# Altium schematic sheet DSP.SchDoc
size 381 x 241 mm
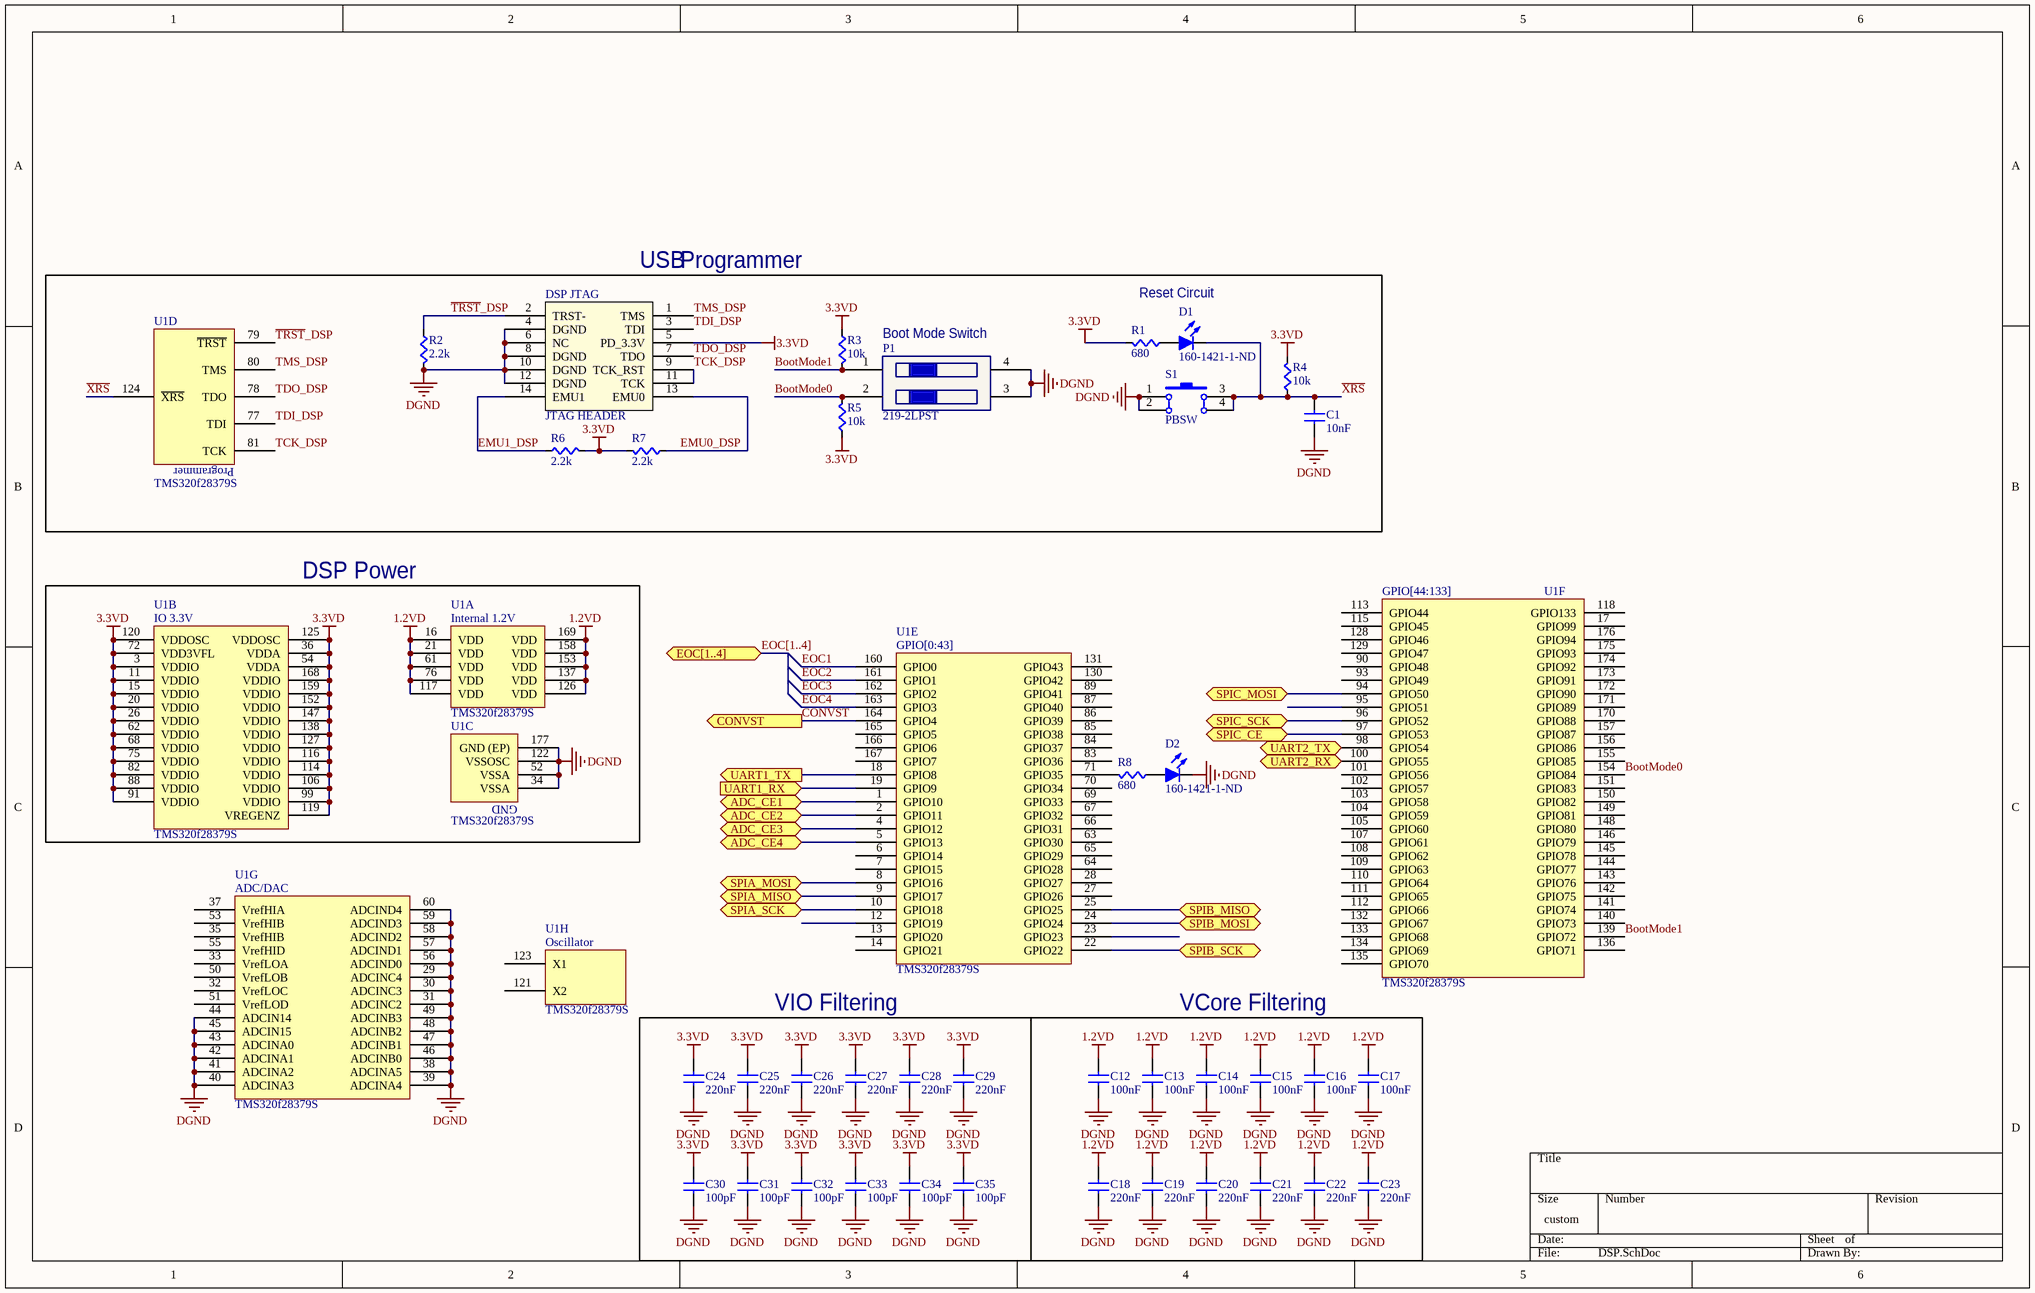
[diagram p0: DSP.SchDoc]

## Parts
C1  value 10nF  [CAPC0603]  (hidden comment: Cap)
C12  value 100nF  [CAPC0603]  (hidden comment: Cap)
C13  value 100nF  [CAPC0603]  (hidden comment: Cap)
C14  value 100nF  [CAPC0603]  (hidden comment: Cap)
C15  value 100nF  [CAPC0603]  (hidden comment: Cap)
C16  value 100nF  [CAPC0603]  (hidden comment: Cap)
C17  value 100nF  [CAPC0603]  (hidden comment: Cap)
C18  value 220nF  [CAPC0603]  (hidden comment: Cap)
C19  value 220nF  [CAPC0603]  (hidden comment: Cap)
C20  value 220nF  [CAPC0603]  (hidden comment: Cap)
C21  value 220nF  [CAPC0603]  (hidden comment: Cap)
C22  value 220nF  [CAPC0603]  (hidden comment: Cap)
C23  value 220nF  [CAPC0603]  (hidden comment: Cap)
C24  value 220nF  [CAPC0603]  (hidden comment: Cap)
C25  value 220nF  [CAPC0603]  (hidden comment: Cap)
C26  value 220nF  [CAPC0603]  (hidden comment: Cap)
C27  value 220nF  [CAPC0603]  (hidden comment: Cap)
C28  value 220nF  [CAPC0603]  (hidden comment: Cap)
C29  value 220nF  [CAPC0603]  (hidden comment: Cap)
C30  value 100pF  [CAPC0603]  (hidden comment: Cap)
C31  value 100pF  [CAPC0603]  (hidden comment: Cap)
C32  value 100pF  [CAPC0603]  (hidden comment: Cap)
C33  value 100pF  [CAPC0603]  (hidden comment: Cap)
C34  value 100pF  [CAPC0603]  (hidden comment: Cap)
C35  value 100pF  [CAPC0603]  (hidden comment: Cap)
D1  Supplier Part Number 1: 160-1421-1-ND  [LED0805-RED]  (hidden comment: LED-RED)
D2  Supplier Part Number: 160-1421-1-ND  [LED0805-RED]  (hidden comment: LED-RED)
DSP_JTAG  JTAG HEADER  [JTAG HEADER - 14]
P1  219-2LPST  [SPST-4N]
R1  value 680  [RES0603]  (hidden comment: Res)
R2  value 2.2k  [RES0603]  (hidden comment: Res)
R3  value 10k  [RES0603]  (hidden comment: Res)
R4  value 10k  [RES0603]  (hidden comment: Res)
R5  value 10k  [RES0603]  (hidden comment: Res)
R6  value 2.2k  [RES0603]  (hidden comment: Res)
R7  value 2.2k  [RES0603]  (hidden comment: Res)
R8  value 680  [RES0603]  (hidden comment: Res)
S1  PBSW  [PBSW]
U1  TMS320f28379S  [PQFP-177N]  (parts A,B,C,D,E,F,G,H of 8)

## Blocks framed on the sheet
DSP Power: U1
VIO Filtering: C24-C35
VCore Filtering: C12-C23

## Ports
ADC_CE1 (bidir), ADC_CE2 (bidir), ADC_CE3 (bidir), ADC_CE4 (bidir), CONVST (out), EOC[1..4] (bidir), SPIA_MISO (bidir), SPIA_MOSI (bidir), SPIA_SCK (bidir), SPIB_MISO (bidir), SPIB_MOSI (bidir), SPIB_SCK (bidir), SPIC_CE (bidir), SPIC_MOSI (bidir), SPIC_SCK (bidir), UART1_RX (in), UART1_TX (out), UART2_RX (in), UART2_TX (out)

## Nets
1: S1.2(A')
1.2VD: C12.1(A) C13.1(A) C14.1(A) C15.1(A) C16.1(A) C17.1(A) C18.1(A) C19.1(A) C20.1(A) C21.1(A) C22.1(A) C23.1(A) U1.16(VDD) U1.21(VDD) U1.61(VDD) U1.76(VDD) U1.117(VDD) U1.126(VDD) U1.137(VDD) U1.153(VDD) U1.158(VDD) U1.169(VDD)
3: S1.4(B')
3.3VD: C24.1(A) C25.1(A) C26.1(A) C27.1(A) C28.1(A) C29.1(A) C30.1(A) C31.1(A) C32.1(A) C33.1(A) C34.1(A) C35.1(A) DSP_JTAG.5(PD_3.3V) R1.1(A) R3.2(B) R4.1(A) R5.2(B) R6.1(A) R7.1(A) U1.3(VDDIO) U1.11(VDDIO) U1.15(VDDIO) U1.20(VDDIO) U1.26(VDDIO) U1.36(VDDA) U1.54(VDDA) U1.62(VDDIO) U1.68(VDDIO) U1.72(VDD3VFL) U1.75(VDDIO) U1.82(VDDIO) U1.88(VDDIO) U1.91(VDDIO) U1.99(VDDIO) U1.106(VDDIO) U1.114(VDDIO) U1.116(VDDIO) U1.119(VREGENZ) U1.120(VDDOSC) U1.125(VDDOSC) U1.127(VDDIO) U1.138(VDDIO) U1.147(VDDIO) U1.152(VDDIO) U1.159(VDDIO) U1.168(VDDIO)
DGND: C1.2(B) C12.2(B) C13.2(B) C14.2(B) C15.2(B) C16.2(B) C17.2(B) C18.2(B) C19.2(B) C20.2(B) C21.2(B) C22.2(B) C23.2(B) C24.2(B) C25.2(B) C26.2(B) C27.2(B) C28.2(B) C29.2(B) C30.2(B) C31.2(B) C32.2(B) C33.2(B) C34.2(B) C35.2(B) D2.1(K) DSP_JTAG.4(DGND) DSP_JTAG.6(NC) DSP_JTAG.8(DGND) DSP_JTAG.10(DGND) DSP_JTAG.12(DGND) P1.3 P1.4 R2.1(A) S1.1(A) S1.2(A') U1.29(ADCINC4) U1.30(ADCINC3) U1.31(ADCINC2) U1.34(VSSA) U1.38(ADCINA5) U1.39(ADCINA4) U1.40(ADCINA3) U1.41(ADCINA2) U1.42(ADCINA1) U1.43(ADCINA0) U1.44(ADCIN14) U1.45(ADCIN15) U1.46(ADCINB0) U1.47(ADCINB1) U1.48(ADCINB2) U1.49(ADCINB3) U1.52(VSSA) U1.56(ADCIND0) U1.57(ADCIND1) U1.58(ADCIND2) U1.59(ADCIND3) U1.60(ADCIND4) U1.122(VSSOSC) U1.177(GND_(EP))
ADC_CE1: U1.1(GPIO10) ; port ADC_CE1
ADC_CE2: U1.2(GPIO11) ; port ADC_CE2
ADC_CE3: U1.4(GPIO12) ; port ADC_CE3
ADC_CE4: U1.5(GPIO13) ; port ADC_CE4
BootMode0: P1.2 R5.1(A) U1.154(GPIO84)
BootMode1: P1.1 R3.1(A) U1.139(GPIO72)
CONVST: U1.164(GPIO4) ; port CONVST
EMU0_DSP: DSP_JTAG.13(EMU0) R7.2(B)
EMU1_DSP: DSP_JTAG.14(EMU1) R6.2(B)
EOC1: U1.160(GPIO0)
EOC2: U1.161(GPIO1)
EOC3: U1.162(GPIO2)
EOC4: U1.163(GPIO3)
SPIA_MISO: U1.9(GPIO17) ; port SPIA_MISO
SPIA_MOSI: U1.8(GPIO16) ; port SPIA_MOSI
SPIA_SCK: U1.10(GPIO18) ; port SPIA_SCK
SPIB_MISO: U1.25(GPIO25) ; port SPIB_MISO
SPIB_MOSI: U1.24(GPIO24) ; port SPIB_MOSI
SPIB_SCK: U1.22(GPIO22) ; port SPIB_SCK
SPIC_CE: U1.97(GPIO53) ; port SPIC_CE
SPIC_MOSI: U1.94(GPIO50) ; port SPIC_MOSI
SPIC_SCK: U1.96(GPIO52) ; port SPIC_SCK
~{TRST}_DSP: DSP_JTAG.2(TRST-) R2.2(B) U1.79(~{TRST})
TCK_DSP: DSP_JTAG.9(TCK_RST) DSP_JTAG.11(TCK) U1.81(TCK)
TDI_DSP: DSP_JTAG.3(TDI) U1.77(TDI)
TDO_DSP: DSP_JTAG.7(TDO) U1.78(TDO)
TMS_DSP: DSP_JTAG.1(TMS) U1.80(TMS)
UART1_RX: U1.19(GPIO9) ; port UART1_RX
UART1_TX: U1.18(GPIO8) ; port UART1_TX
UART2_RX: U1.100(GPIO55) ; port UART2_RX
UART2_TX: U1.98(GPIO54) ; port UART2_TX
~{XRS}: C1.1(A) D1.1(K) R4.2(B) S1.3(B) S1.4(B') U1.124(~{XRS})
NetD1_2: D1.2(A) R1.2(B)
NetD2_2: D2.2(A) R8.2(B)
NetR8_1: R8.1(A) U1.71(GPIO35)

Not connected (* = marked no-connect by the designer): U1 6(GPIO14) 7(GPIO15) 12(GPIO19) 13(GPIO20) 14(GPIO21) 17(GPIO99) 23(GPIO23) 27(GPIO26) 28(GPIO27) 32(VrefLOC) 33(VrefLOA) 35(VrefHIB) 37(VrefHIA) 50(VrefLOB) 51(VrefLOD) 53(VrefHIB) 55(VrefHID) 63(GPIO30) 64(GPIO28) 65(GPIO29) 66(GPIO31) 67(GPIO32) 69(GPIO33) 70(GPIO34) 83(GPIO36) 84(GPIO37) 85(GPIO38) 86(GPIO39) 87(GPIO40) 89(GPIO41) 90(GPIO48) 93(GPIO49) 95(GPIO51) 101(GPIO56) 102(GPIO57) 103(GPIO58) 104(GPIO59) 105(GPIO60) 107(GPIO61) 108(GPIO62) 109(GPIO63) 110(GPIO64) 111(GPIO65) 112(GPIO66) 113(GPIO44) 115(GPIO45) 118(GPIO133) 121(X2) 123(X1) 128(GPIO46) 129(GPIO47) 130(GPIO42) 131(GPIO43) 132(GPIO67) 133(GPIO68) 134(GPIO69) 135(GPIO70) 136(GPIO71) 140(GPIO73) 141(GPIO74) 142(GPIO75) 143(GPIO76) 144(GPIO77) 145(GPIO78) 146(GPIO79) 148(GPIO80) 149(GPIO81) 150(GPIO82) 151(GPIO83) 155(GPIO85) 156(GPIO86) 157(GPIO87) 165(GPIO5) 166(GPIO6) 167(GPIO7) 170(GPIO88) 171(GPIO89) 172(GPIO90) 173(GPIO91) 174(GPIO92) 175(GPIO93) 176(GPIO94)

## Buses and harness runs
bus EOC[1..4] = port EOC[1..4]

## Notes on the sheet
- (near DSP_JTAG) USB
- Programmer
- Reset Circuit
- Boot Mode Switch
- (in symbol TMS320f28379S, part A) Internal 1.2V
- (in symbol TMS320f28379S, part B) IO 3.3V
- (in symbol TMS320f28379S, part C) GND
- (in symbol TMS320f28379S, part D) Programmer
- (in symbol TMS320f28379S, part E) GPIO[0:43]
- (in symbol TMS320f28379S, part F) GPIO[44:133]
- (in symbol TMS320f28379S, part G) ADC/DAC
- (in symbol TMS320f28379S, part H) Oscillator

## Library data of the parts
D1 D2 = LED-RED: Light Emitting Diode - RED; Manufacturer Part Number: LTST-C171CKT; Manufacturer: Lite-On Inc; Voltage - Forward (Vf) Typ: 1.8V; Current - Test: 20mA; Millicandela Rating: 25mcd; Viewing Angle: 130°; Color: Red; Package / Case: 0805 (2012 Metric)
  D1: Supplier 1: Digi-Key
  D2: Supplier: Digi-Key
DSP_JTAG = JTAG-TI_14: 14 Pin JTAG Header; Supplier Part Number 1: 609-3491-ND; Supplier 1: Digi-Key
P1 = SPST-2DIP-SW: SWITCH TAPE SEAL 2 POS SMD 50V; Supplier 1: Digi-Key; Supplier Part Number 1: CT2192LPST-ND
S1 = SW-PB: Push Button Switch; Manufacturer: Panasonic Electronic Components; Manufacturer Part Number: EVQ-9P105M; Outline: 6.10mm x 6.00mm; Actuator Orientation: Top Actuated; Actuator Height off PCB, from Pins: 5.00mm; Published: 24-Mar-1999; LatestRevisionDate: 17-Jul-2002; LatestRevisionNote: Re-released for DXP Platform.; PackageReference: SPST-2; Publisher: Altium Limited; PackageDescription: Switch; 2 Leads; Supplier 1: Digi-Key; Supplier Part Number 1: P13586SCT-ND
U1 = TMS320f28379S: IC MCU 200MHZ FPU DSP; Supplier 1: Digi-Key; Supplier Part Number 1: TMS320F28379SPTPT-ND
C1 C12-C35 = Cap: Supplier 1: Digi-Key; Supplier Part Number 1: 1276-1000-1-ND
R1-R8 = Res: Supplier 1: Digi-Key; Supplier Part Number 1: RMCF0603JT10K0CT-ND